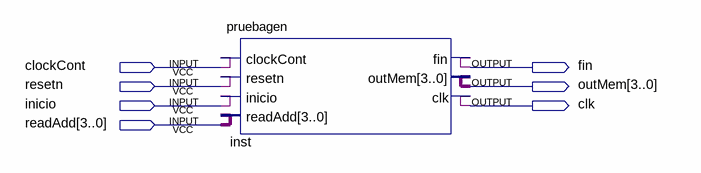
[diagram p0: schematic sheet]
// Quartus schematic pruebaGenerar.bdf as structural Verilog: 1 symbols, 7 pins
module pruebaGenerar (
  input  clockCont,
  input  resetn,
  input  inicio,
  input  [3:0] readAdd,
  output fin,
  output [3:0] outMem,
  output clk
);

  pruebagen inst (
    .clockCont(clockCont), .resetn(resetn), .inicio(inicio), .readAdd(readAdd), .fin(fin), .outMem(outMem),
    .clk(clk));
endmodule
